# Altium schematic sheet Sensado.SchDoc
size A4
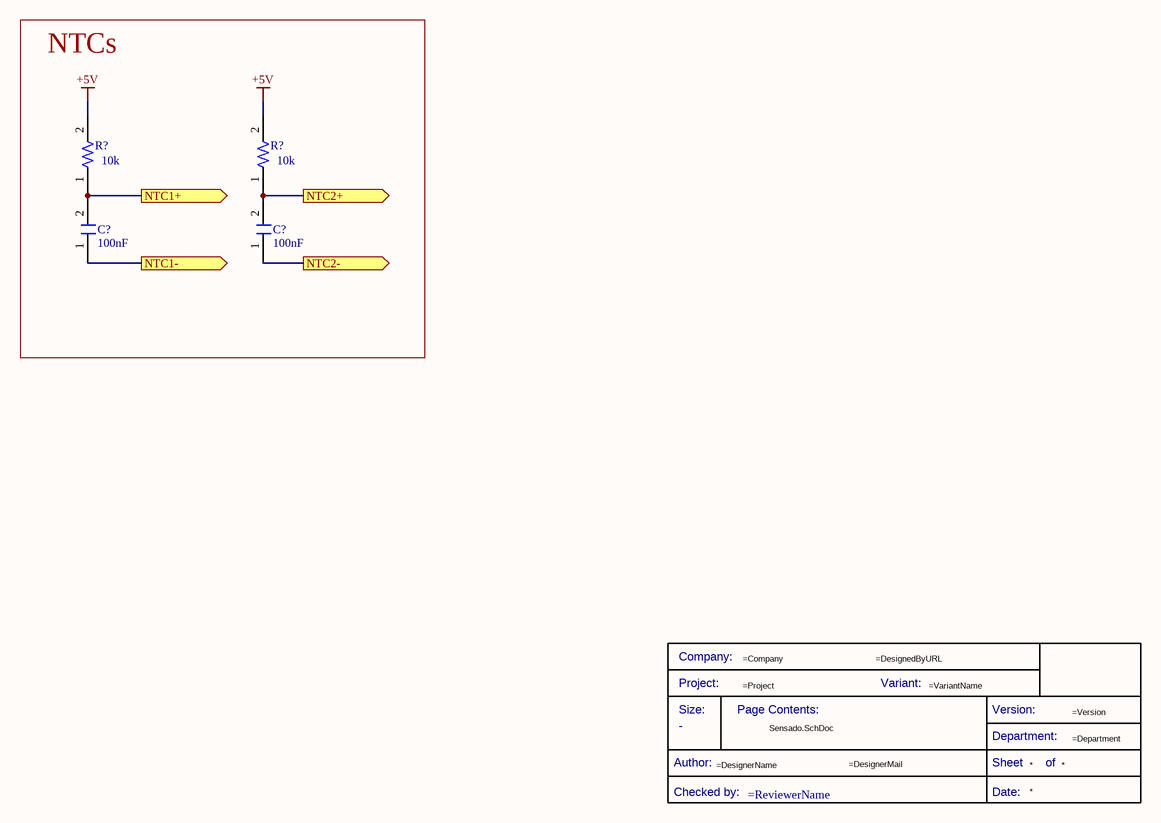
[diagram p0: Sensado.SchDoc]

## Parts
(Parts that share a designator on the sheet are numbered #1, #2 ... from top to bottom, then left to right.)
*  Title Block_template  (value not drawn)  (graphical)
C?#1  value 100nF  [C1206FNPC-RW]  (hidden comment: C100n-10V-1206FNPC-X7R)
C?#2  value 100nF  [C1206FNPC-RW]  (hidden comment: C100n-10V-1206FNPC-X7R)
R?#1  value 10k  [R0805FTK]  (hidden comment: R10k-0805FTK)
R?#2  value 10k  [R0805FTK]  (hidden comment: R10k-0805FTK)

## Blocks framed on the sheet
NTCs: C?#1 C?#2 R?#1 R?#2

## Ports
NTC1+ (out), NTC1- (out), NTC2+ (out), NTC2- (out)

## Nets
+5V: R?#1.2 R?#2.2
NTC1+: C?#1.2 R?#1.1 ; port NTC1+
NTC1-: C?#1.1 ; port NTC1-
NTC2+: C?#2.2 R?#2.1 ; port NTC2+
NTC2-: C?#2.1 ; port NTC2-

## Notes on the sheet
- (in symbol Title Block_template) Company:; Project:; Variant:; Size:; Page Contents:; Version:; Department:; Author:; Sheet; of; Checked by:; Date:

## Library data of the parts
* = Title Block_template: Standard Title Block; .Creator: GP; Category: Title Block; .PCBcheck: GP; .SCHcheck: GP; Checked by:: =ReviewerName; Size: -
C?#1 C?#2 = CMP-00061-1: Cap, 0.1ΜF, 10V, 10%, X7R, 1206; Manufacturer Part Number 1: 885012208009; Manufacturer 1: Wurth Electronics; .Creator: GP; ComponentLink4Description: Wurth Elektronik; Voltage Rating: 10V; ComponentLink4URL: https://www.we-online.com/catalog/en/WCAP-CSGP-10VDC?sq=885012208009#885012208009; Mount: Surface Mount; ComponentLink3URL: https://katalog.we-online.de/pbs/datasheet/885012208009.pdf?src-supplier=Digi-Key; ComponentLink3Description: https://katalog.we-online.de/pbs/datasheet/885012208009.pdf?src-supplier=Digi-Key; Design Item ID: C100n-10V-1206FNPC-X7R; Max Operating Temperature: 125°C; Width: 0.063inch; ComponentLink2Description: http://katalog.we-online.de/pbs/datasheet/885012208009.pdf?src-supplier=Digi-Key; Tolerance: 10%; Case/Package: 1206; Pricing 1: 1=0,11000, 10=0,10300, 100=0,09200, 500=0,08100 (USD); Source: Passives.SchLib; ComponentLink1URL: http://www.farnell.com/datasheets/2031891.pdf?src-supplier=Farnell; Category: Ceramic Capacitors; Thickness: 0.035inch; ComponentLink1Description: http://www.farnell.com/datasheets/2031891.pdf?src-supplier=Farnell; Min Operating Temperature: -55°C; Stock 1: 7198; Length: 0.126inch; ComponentLink2URL: http://katalog.we-online.de/pbs/datasheet/885012208009.pdf?src-supplier=Digi-Key; Case Code (Metric): 3216; RoHS: Yes; RoHS Compliant: Yes; Packaging: Tape and Reel
R?#1 R?#2 = CMP-00085-3: BOURNS         CR0805-JW-103ELF            Surface Mount Chip Resistor, Thick Film, CR Series, 10 kohm, 125 mW,  5%, 150 V; Voltage Rating: 150V; Max Power Dissipation: 125mW; .Creator: DR; Temperature Coefficient: 200ppm/°C; Voltage Rating (DC): 100V; ComponentLink8Description: https://datasheet.ciiva.com/6559/chpreztr-6559900.pdf?src-supplier=Digi-Key; Depth: 1.25mm; ComponentLink4URL: https://datasheet.ciiva.com/7986/691949-7986187.pdf?src-supplier=Element14; RoHS Compliant: Yes; ComponentLink5Description: https://datasheet.ciiva.com/30065/159chpreztr-30065976.pdf?src-supplier=Onlinecomponents.com; Height: 0.5mm; ComponentLink9URL: https://datasheet.ciiva.com/6559/chpreztr-6559901.pdf?src-supplier=Digi-Key; REACH SVHC: No SVHC; ComponentLink2Description: https://datasheet.ciiva.com/9122/chpreztr-9122374.pdf?src-supplier=Avnet; ComponentLink1URL: https://datasheet.ciiva.com/11821/0900766b80fcdb72-11821135.pdf?src-supplier=RSComponents; ComponentLink7Description: https://datasheet.ciiva.com/5548/chpreztr-5548491.pdf?src-supplier=Mouser; Termination: SMD/SMT; RoHS: Yes; Length: 2mm; Pins: 2; Radiation Hardening: No; Thickness: 508um; Width: 1.25mm; Pricing 1: 1=0,05790, 10=0,01540, 25=0,01340, 100=0,00340 (USD); Resistor Type: Thick Film; Stock 1: 57566; Package Quantity: 1; ComponentLink4Description: https://datasheet.ciiva.com/7986/691949-7986187.pdf?src-supplier=Element14; ComponentLink5URL: https://datasheet.ciiva.com/30065/159chpreztr-30065976.pdf?src-supplier=Onlinecomponents.com; Mount: Surface Mount; Resistance Tolerance: 5%; Tolerance: 5%; Construction: Rectangular; ComponentLink11Description: https://datasheet.ciiva.com/48692/001055517-da-01-en-smd-wid-cr0805-jw-103elf-10k-ohm-1-8w-48692118.pdf?src-supplier=Conrad; ComponentLink6Description: https://datasheet.ciiva.com/16783/70154685-16783482.pdf?src-supplier=Allied+Electronics; ComponentLink10URL: https://datasheet.ciiva.com/7985/1856384-7985869.pdf?src-supplier=Element14; Case Code (Metric): 2012; Technology: THICK FILM; ComponentLink3Description: https://datasheet.ciiva.com/22693/1902866-22693254.pdf?src-supplier=Element14; Min Operating Temperature: -55°C; Manufacturer 1: Bourns; ComponentLink2URL: https://datasheet.ciiva.com/9122/chpreztr-9122374.pdf?src-supplier=Avnet; Military Standard: Not; Features: Moisture Resistant; ComponentLink7URL: https://datasheet.ciiva.com/5548/chpreztr-5548491.pdf?src-supplier=Mouser; Design Item ID: R10k-0805FTK; ComponentLink9Description: https://datasheet.ciiva.com/6559/chpreztr-6559901.pdf?src-supplier=Digi-Key; Power Rating: 125mW; ComponentLink11URL: https://datasheet.ciiva.com/48692/001055517-da-01-en-smd-wid-cr0805-jw-103elf-10k-ohm-1-8w-48692118.pdf?src-supplier=Conrad; ComponentLink8URL: https://datasheet.ciiva.com/6559/chpreztr-6559900.pdf?src-supplier=Digi-Key; Contact Plating: Tin; ComponentLink10Description: https://datasheet.ciiva.com/7985/1856384-7985869.pdf?src-supplier=Element14; Manufacturer Part Number 1: CR0805-JW-103ELF; Packaging: Tape and Reel; ComponentLink3URL: https://datasheet.ciiva.com/22693/1902866-22693254.pdf?src-supplier=Element14; ComponentLink6URL: https://datasheet.ciiva.com/16783/70154685-16783482.pdf?src-supplier=Allied+Electronics; ComponentLink1Description: https://datasheet.ciiva.com/11821/0900766b80fcdb72-11821135.pdf?src-supplier=RSComponents; Series: CR0805; Category: Chip SMD Resistors; Number of Terminations: 2; Max Operating Temperature: 155°C; Source: Passives.SchLib; Case/Package: 0805